# EAGLE board TAMSAT_OBC_v113 (EAGLE 6.5.0), part 1 of 2
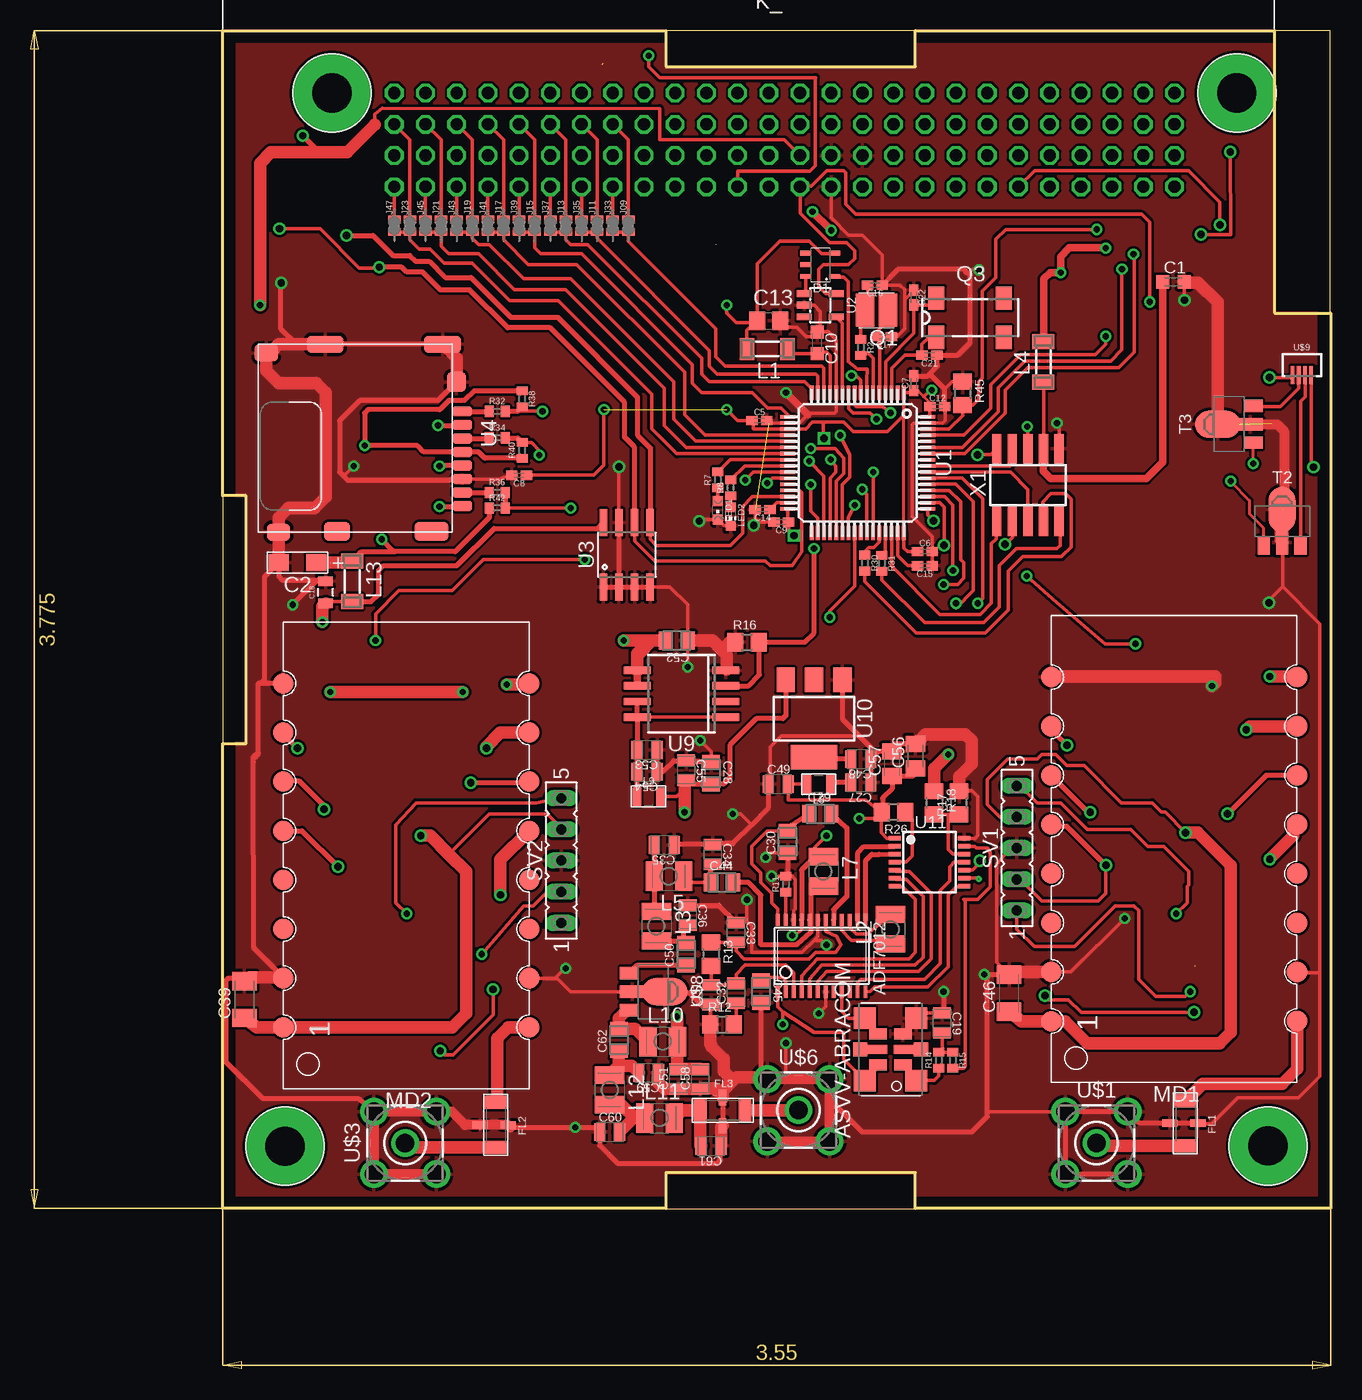
[diagram p4: board, top side]
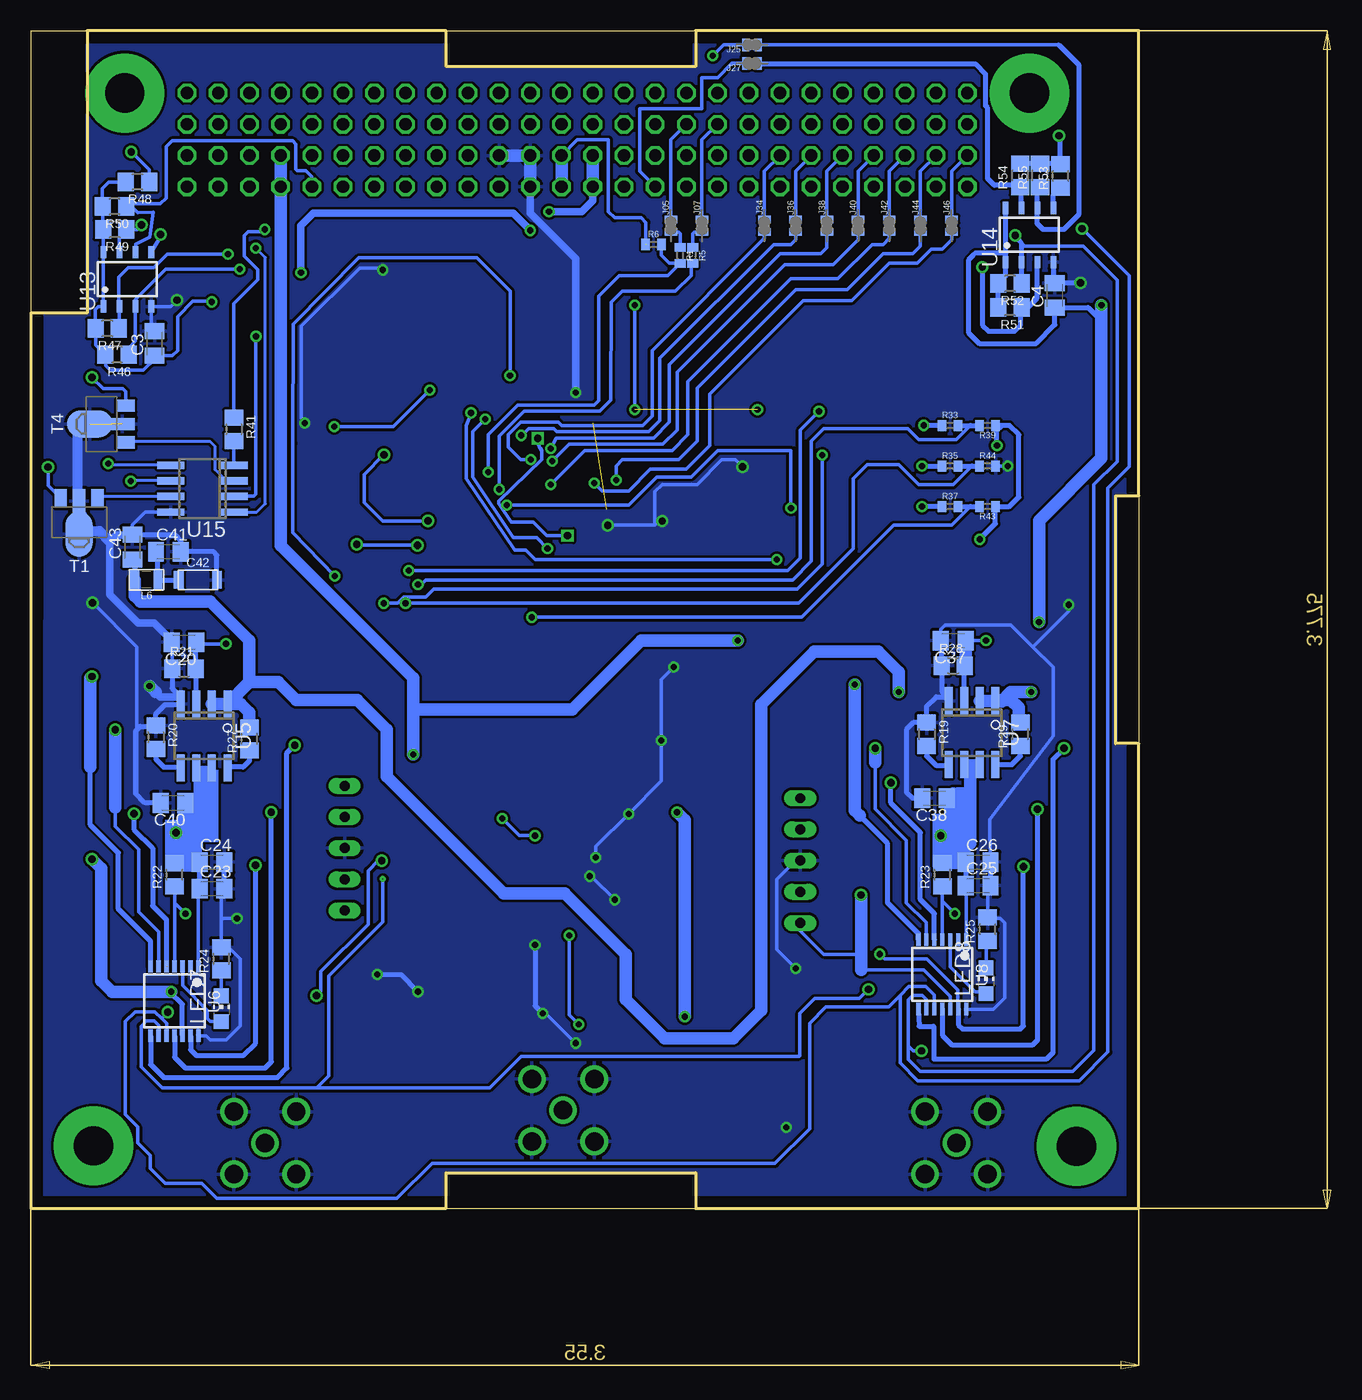
[diagram p5: board, bottom side, seen from below]

Size 90.19 x 95.89 mm. Coordinates in mm from the lower left corner, seen from the top.
Outline: 0,0 90.19,0 90.14,95.89 0,95.89 0,0
Copper layers (1*16): Top 0.035mm / dielectric 1.5mm / Bottom 0.035mm
Design rules "default": minimum track width 10mil, minimum drill 24mil, track to track 8mil, track to pad 8mil, pad to pad 8mil, via to via 8mil, smd to smd 8mil, copper to edge 40mil, drill to drill 8mil, minimum pad ring 10mil, minimum via ring 8mil, stop-mask expansion 4mil, vias tented up to drill 0mil, thermal gap 10mil
Net classes: 0 default: clearance 0.205 mm; 1 vcc: width 0.254 mm
Milling: 18 lines

## Footprints (pad centres in the part's own frame; a part is rotated, then mirrored left to right if it is on the bottom)
CRYSTAL-SMD-7.5X5.2-6PIN = smd 1.778 x 1.778: 1 -2.54,-2.1; 3 2.54,-2.1; 4 2.54,2.1; 6 -2.54,2.1 | smd 0.889 x 1.422: 1INNER -1.27,-1.016; 3INNER 1.27,-1.016; 4INNER 1.27,1.016; 6INNER -1.27,1.016 | smd 1.143 x 1.143: 2 0,-2.481; 5 0,2.481 | smd 0.711 x 1.778: 2INNER 0,-1.143; 5INNER 0,1.143
C0603K = smd 1.05 x 1.08: 1 -0.875,0; 2 0.875,0
C1206(3216) = smd 1.65 x 1.4: 1 -1.525,0; 2 1.525,0
C0805K = smd 1.3 x 1.6: 1 -1,0; 2 1,0
C0402K = smd 0.925 x 0.74: 1 -0.6,0; 2 0.6,0
C0805 = smd 1.3 x 1.5: 1 -0.95,0; 2 0.95,0
0805 = smd 0.8 x 1.2: 1 -0.9,0; 2 0.9,0
CAPC2013X140N = smd 0.914 x 1.448: 1 -0.813,0; 2 0.813,0
CAPC2012X94N = smd 1.118 x 1.448: 1 -0.914,0; 2 0.914,0
C1206K = smd 1.5 x 2: 1 -1.5,0; 2 1.5,0
C1206-GCM31 = smd 0.8 x 1.4: P$1 -1.55,0; P$2 1.55,0
SOT-25 = smd 0.9 x 0.4: 1 -1.175,0.95; 2 -1.175,-0.95; 3 1.175,-0.95; 4 1.175,0; 5 1.175,0.95
LFCN-XXX = smd 1.041 x 1.803: P$1 0,0; P$2 3.658,0 | smd 0.61 x 1.245: P$3 1.829,-1.27; P$4 1.829,1.016
JUMPER_MINI = smd 0.584 x 1.016: 1 -0.508,0; 2 0.508,0
CUBESAT_BRD = drill 1 pad 1.5 octagon: 1 13.97,88.265; 2 13.97,90.805; 3 16.51,88.265; 4 16.51,90.805; 5 19.05,88.265; 6 19.05,90.805; 7 21.59,88.265; 8 21.59,90.805; 9 24.13,88.265; 10 24.13,90.805; 11 26.67,88.265; 12 26.67,90.805; 13 29.21,88.265; 14 29.21,90.805; 15 31.75,88.265; 16 31.75,90.805; 17 34.29,88.265; 18 34.29,90.805; 19 36.83,88.265; 20 36.83,90.805; 21 39.37,88.265; 22 39.37,90.805; 23 41.91,88.265; 24 41.91,90.805; 25 44.45,88.265; 26 44.45,90.805; 27 46.99,88.265; 28 46.99,90.805; 29 49.53,88.265; 30 49.53,90.805; 31 52.07,88.265; 32 52.07,90.805; 33 54.61,88.265; 34 54.61,90.805; 35 57.15,88.265; 36 57.15,90.805; 37 59.69,88.265; 38 59.69,90.805; 39 62.23,88.265; 40 62.23,90.805; 41 64.77,88.265; 42 64.77,90.805; 43 67.31,88.265; 44 67.31,90.805; 45 69.85,88.265; 46 69.85,90.805; 47 72.39,88.265; 48 72.39,90.805; 49 74.93,88.265; 50 74.93,90.805; 51 77.47,88.265; 52 77.47,90.805; 53 13.97,83.185; 54 13.97,85.725; 55 16.51,83.185; 56 16.51,85.725; 57 19.05,83.185; 58 19.05,85.725; 59 21.59,83.185; 60 21.59,85.725; 61 24.13,83.185; 62 24.13,85.725; 63 26.67,83.185; 64 26.67,85.725; 65 29.21,83.185; 66 29.21,85.725; 67 31.75,83.185; 68 31.75,85.725; 69 34.29,83.185; 70 34.29,85.725; 71 36.83,83.185; 72 36.83,85.725; 73 39.37,83.185; 74 39.37,85.725; 75 41.91,83.185; 76 41.91,85.725; 77 44.45,83.185; 78 44.45,85.725; 79 46.99,83.185; 80 46.99,85.725; 81 49.53,83.185; 82 49.53,85.725; 83 52.07,83.185; 84 52.07,85.725; 85 54.61,83.185; 86 54.61,85.725; 87 57.15,83.185; 88 57.15,85.725; 89 59.69,83.185; 90 59.69,85.725; 91 62.23,83.185; 92 62.23,85.725; 93 64.77,83.185; 94 64.77,85.725; 95 67.31,83.185; 96 67.31,85.725; 97 69.85,83.185; 98 69.85,85.725; 99 72.39,83.185; 100 72.39,85.725; 101 74.93,83.185; 102 74.93,85.725; 103 77.47,83.185; 104 77.47,85.725
SM-1206 = smd 1.2 x 1.8: 1 -1.65,0; 2 1.65,0
L2825P = smd 1.4 x 2.4: 1 -1.2,0; 2 1.2,0
L805 = smd 0.7 x 1.5: 1 -0.95,0; 2 0.95,0
CHIPLED_0603 = smd 0.8 x 0.8: A 0,-0.75; C 0,0.75
CHIP-LED0603 = smd 0.8 x 0.8: A 0,-0.75; C 0,0.75
CHIP-LED0805 = smd 1.2 x 1.2: A 0,-1.05; C 0,1.05
RF4463F30 = smd 1.651 x 1.651: 1 33.02,0; 2 29,0; 3 25,0; 4 21,0; 5 17,0; 6 13,0; 7 9,0; 8 5,0; 9 5,20; 10 9,20; 11 13,20; 12 17,20; 13 21,20; 14 25,20; 15 29,20; 16 33,20
XTAL_SMD2 = smd 1.5 x 2.7: 1 -0.95,0.025; 2 0.95,0.025
MC-306 = smd 1.3 x 1.9: 1 -2.75,-1.6; 2 2.75,-1.6; 3 2.75,1.6; 4 -2.75,1.6
R0402 = smd 0.7 x 0.9: 1 -0.65,0; 2 0.65,0
R0805 = smd 1.3 x 1.5: 1 -0.95,0; 2 0.95,0
FE05-1 = drill 0.813 long: 1 -5.08,0; 2 -2.54,0; 3 0,0; 4 2.54,0; 5 5.08,0
SOT-89 = smd 1 x 1.5: 1 -1.499,-1.981; 3 1.499,-1.981 | smd 1 x 2: 2 0,-1.727 | smd 2.2 x 3.7: 2@1 0,0.94
TQFP64 = smd 1.2 x 0.3: 1 -5.7,3.75; 2 -5.7,3.25; 3 -5.7,2.75; 4 -5.7,2.25; 5 -5.7,1.75; 6 -5.7,1.25; 7 -5.7,0.75; 8 -5.7,0.25; 9 -5.7,-0.25; 10 -5.7,-0.75; 11 -5.7,-1.25; 12 -5.7,-1.75; 13 -5.7,-2.25; 14 -5.7,-2.75; 15 -5.7,-3.25; 16 -5.7,-3.75; 33 5.7,-3.75; 34 5.7,-3.25; 35 5.7,-2.75; 36 5.7,-2.25; 37 5.7,-1.75; 38 5.7,-1.25; 39 5.7,-0.75; 40 5.7,-0.25; 41 5.7,0.25; 42 5.7,0.75; 43 5.7,1.25; 44 5.7,1.75; 45 5.7,2.25; 46 5.7,2.75; 47 5.7,3.25; 48 5.7,3.75 | smd 0.3 x 1.2: 17 -3.75,-5.7; 18 -3.25,-5.7; 19 -2.75,-5.7; 20 -2.25,-5.7; 21 -1.75,-5.7; 22 -1.25,-5.7; 23 -0.75,-5.7; 24 -0.25,-5.7; 25 0.25,-5.7; 26 0.75,-5.7; 27 1.25,-5.7; 28 1.75,-5.7; 29 2.25,-5.7; 30 2.75,-5.7; 31 3.25,-5.7; 32 3.75,-5.7; 49 3.75,5.7; 50 3.25,5.7; 51 2.75,5.7; 52 2.25,5.7; 53 1.75,5.7; 54 1.25,5.7; 55 0.75,5.7; 56 0.25,5.7; 57 -0.25,5.7; 58 -0.75,5.7; 59 -1.25,5.7; 60 -1.75,5.7; 61 -2.25,5.7; 62 -2.75,5.7; 63 -3.25,5.7; 64 -3.75,5.7
SOT23-5 = smd 0.55 x 1.2: 1 -0.95,-1.3; 2 0,-1.3; 3 0.95,-1.3; 4 0.95,1.3; 5 -0.95,1.3
SO08 = smd 0.61 x 2.21: 1 -1.905,-2.616; 2 -0.635,-2.616; 3 0.635,-2.616; 4 1.905,-2.616; 5 1.905,2.616; 6 0.635,2.616; 7 -0.635,2.616; 8 -1.905,2.616
MICROSD = smd 0.8 x 1.6: 1 -2.03,9.47; 2 -0.93,9.47; 3 0.17,9.47; 4 1.27,9.47; 5 2.37,9.47; 6 3.47,9.47; 7 4.57,9.47; 8 5.67,9.47 | smd 1.55 x 2.8: 9 7.735,6.97 | smd 1.55 x 2.1: 10 7.735,-0.73 | smd 1.4 x 1.9: 11 7.81,-5.48; 12 -6.79,-6.48 | smd 1.4 x 3: 13 -7.49,-1.68; 14 -7.49,7.87 | smd 1.6 x 1.55: 15 -4.43,8.995
SO8 = smd 0.65 x 2.2: 1 -1.905,-2.6; 2 -0.635,-2.6; 3 0.635,-2.6; 4 1.905,-2.6; 5 1.905,2.6; 6 0.635,2.6; 7 -0.635,2.6; 8 -1.905,2.6
TSSOP14 = smd 0.35 x 1: 1 -1.95,-2.825; 2 -1.3,-2.825; 3 -0.65,-2.825; 4 0,-2.825; 5 0.65,-2.825; 6 1.3,-2.825; 7 1.95,-2.825; 8 1.95,2.825; 9 1.3,2.825; 10 0.65,2.825; 11 0,2.825; 12 -0.65,2.825; 13 -1.3,2.825; 14 -1.95,2.825
SOP-08 = smd 0.6 x 2.2: 1 -1.905,-3.6; 2 -0.635,-3.6; 3 0.635,-3.6; 4 1.905,-3.6; 5 1.905,3.575; 6 0.635,3.575; 7 -0.635,3.575; 8 -1.905,3.575
SOT223 = smd 1.5 x 2: 1 -2.3,-3.15; 2 0,-3.15; 3 2.3,-3.15 | smd 3.8 x 2: 4 0,3.15
ADF7012 = smd 0.991 x 0.305: 1_DVDD -2.918,3.829; 2_CREG1 -2.918,3.179; 3_CPOUT -2.918,2.529; 4_TXDATA -2.918,1.879; 5_TXCLK -2.918,1.229; 6_MUXOUT -2.918,0.579; 7_DGND -2.918,-0.071; 8_OSC1 -2.918,-0.721; 9_OSC2 -2.918,-1.371; 10_CLKOUT -2.918,-2.021; 11_CLK -2.918,-2.671; 12_DATA -2.918,-3.321; 13_LE 2.918,-3.321; 14_CE 2.918,-2.671; 15_L1 2.918,-2.021; 16_L2 2.918,-1.371; 17_CVCO 2.918,-0.721; 18_VCOIN 2.918,-0.071; 19_RFGND 2.918,0.579; 20_RFOUT 2.918,1.229; 21_DVDD 2.918,1.879; 22_AGND 2.918,2.529; 23_RSET 2.918,3.179; 24_CREG2 2.918,3.829
DGK-R-PDSO-G8 = smd 0.45 x 1: 1 -1.95,-2.21; 2 -0.65,-2.21; 3 0.65,-2.21; 4 1.95,-2.21; 5 1.95,2.21; 6 0.65,2.21; 7 -0.65,2.21; 8 -1.95,2.21
SO-08 = smd 0.6 x 2.2: 1 -1.905,-2.6; 2 -0.635,-2.6; 3 0.635,-2.6; 4 1.905,-2.6; 5 1.905,2.6; 6 0.635,2.6; 7 -0.635,2.6; 8 -1.905,2.6
SMA = drill 1.5 pad 2.2: 1 0,0; 2 -2.54,2.54; 3 2.54,2.54; 4 2.54,-2.54; 5 -2.54,-2.54
ANT_CON = smd 0.3 x 1.5: 1 -1.25,2.5; 2 -0.75,2.5; 3 -0.25,2.5; 4 0.25,2.5
1365-10 = smd 0.76 x 2.4: 1 -2.54,-2.95; 2 -2.54,2.95; 3 -1.27,-2.95; 4 -1.27,2.95; 5 0,-2.95; 6 0,2.95; 7 1.27,-2.95; 8 1.27,2.95; 9 2.54,-2.95; 10 2.54,2.95

## Placement (x,y rotation side)
ASVV-ABRACOM  OSCILLATORSMD6  [CRYSTAL-SMD-7.5X5.2-6PIN]  54.36,12.97 90 top
C1  1uF  [C0603K]  77.38,75.45 0 top
C2  10uF  [C1206(3216)]  6.1,52.59 180 top
C3  10nF  [C0805K]  80.11,70.43 90 bottom
C4  10nF  [C0805K]  6.85,74.36 90 bottom
C5  100nF  [C0402K]  43.69,64.15 0 top
C6  100nF  [C0402K]  57.15,53.48 0 top
C7  100nF  [C0402K]  56.26,67.2 90 top
C8  100nF  [C0402K]  24.13,59.71 180 top
C9  100nF  [C0402K]  45.47,55.9 180 top
C10  100nF  [C0603K]  48.39,70.5 270 top
C12  100nF  [C0402K]  58.17,65.29 0 top
C13  1uF  [C0805]  44.45,72.28 0 top
C14  2.2uF  [C0402K]  43.94,56.91 180 top
C15  2.2uF  [C0402K]  57.15,52.34 180 top
C16  22pF  [C0402K]  53.09,75.2 180 top
C17  22pF  [C0402K]  53.85,71.01 180 top
C18  10nF  [0805]  8.38,50.18 90 top
C19  [CAPC2013X140N]  58.55,15.13 270 top
C20  1uF  [C0805K]  77.72,46.12 180 bottom
C21  6.8pF  [C0402K]  57.53,69.48 180 top
C22  6.8pF  [C0402K]  56.26,74.18 270 top
C23  100nF  [C0805K]  75.44,26.05 0 bottom
C24  100pF  [C0805K]  75.44,28.21 0 bottom
C25  100nF  [C0805K]  13.08,26.3 0 bottom
C26  100pF  [C0805K]  13.08,28.21 0 bottom
C27  10UF  [CAPC2013X140N]  51.94,34.69 180 top
C28  0.1UF  [CAPC2012X94N]  39.75,35.45 270 top
C29  22n  [CAPC2012X94N]  48.64,32.15 0 top
C30  470n  [CAPC2012X94N]  45.97,29.86 90 top
C31  [CAPC2013X140N]  39.75,17.41 90 top
C32  [CAPC2013X140N]  41.78,17.54 90 top
C33  [CAPC2013X140N]  41.78,22.49 270 top
C34  [CAPC2013X140N]  39.88,28.84 270 top
C35  [CAPC2013X140N]  35.94,29.61 180 top
C36  [CAPC2013X140N]  37.85,23.89 270 top
C37  1uF  [C0805K]  15.11,46.24 180 bottom
C38  100nF  [C0805K]  16.64,33.42 180 bottom
C39  10uF  [C1206K]  1.78,17.03 90 top
C40  100nF  [C0805K]  78.61,33.04 180 bottom
C41  10nF  [C0805K]  78.99,53.48 0 bottom
C42  22uF,1210  [C1206-GCM31]  76.58,51.2 0 bottom
C43  100nF  [C0805K]  81.91,53.86 90 bottom
C44  [CAPC2012X94N]  40.64,26.56 0 top
C45  [CAPC2012X94N]  43.82,17.67 270 top
C46  10uF  [C1206K]  64.01,17.54 90 top
C48  100n  [CAPC2013X140N]  51.94,36.59 180 top
C49  100n  [CAPC2013X140N]  45.21,34.56 0 top
C50  [CAPC2012X94N]  37.72,20.72 90 top
C51  [CAPC2013X140N]  37.08,10.56 90 top
C52  0.1UF  [CAPC2012X94N]  36.96,46.24 180 top
C53  10UF  [CAPC2013X140N]  34.54,37.35 180 top
C54  100n  [CAPC2013X140N]  34.54,35.58 180 top
C55  100n  [CAPC2013X140N]  37.72,35.7 270 top
C56  100nF  [C0805K]  56.39,36.84 90 top
C57  100pF  [C0805K]  54.48,36.21 90 top
C58  [CAPC2013X140N]  38.86,10.56 90 top
C59  [CAPC2013X140N]  34.67,11.06 180 top
C60  [CAPC2013X140N]  31.5,6.24 0 top
C61  [CAPC2013X140N]  39.75,5.1 180 top
C62  [CAPC2012X94N]  32.26,13.73 90 top
D1  SBE805  [SOT-25]  48.64,76.85 180 top
FL1  LFCN-XXX  [LFCN-XXX]  78.36,8.78 270 top
FL2  LFCN-XXX  [LFCN-XXX]  22.23,8.65 270 top
FL3  LFCN-XXX  [LFCN-XXX]  38.86,8.02 0 top
J05  [JUMPER_MINI]  38.1,80.03 90 bottom
J07  [JUMPER_MINI]  35.56,80.03 90 bottom
J09  [JUMPER_MINI]  33.02,80.03 90 top
J11  [JUMPER_MINI]  30.48,80.03 90 top
J13  [JUMPER_MINI]  27.94,80.03 90 top
J15  [JUMPER_MINI]  25.4,80.03 90 top
J17  [JUMPER_MINI]  22.86,80.03 90 top
J19  [JUMPER_MINI]  20.32,80.03 90 top
J21  [JUMPER_MINI]  17.78,80.03 90 top
J23  [JUMPER_MINI]  15.24,80.03 90 top
J25  [JUMPER_MINI]  31.5,94.76 180 bottom
J27  [JUMPER_MINI]  31.5,93.23 180 bottom
J33  [JUMPER_MINI]  31.75,80.03 90 top
J34  [JUMPER_MINI]  30.48,80.03 90 bottom
J35  [JUMPER_MINI]  29.21,80.03 90 top
J36  [JUMPER_MINI]  27.94,80.03 90 bottom
J37  [JUMPER_MINI]  26.67,80.03 90 top
J38  [JUMPER_MINI]  25.4,80.03 90 bottom
J39  [JUMPER_MINI]  24.13,80.03 90 top
J40  [JUMPER_MINI]  22.86,80.03 90 bottom
J41  [JUMPER_MINI]  21.59,80.03 90 top
J42  [JUMPER_MINI]  20.32,80.03 90 bottom
J43  [JUMPER_MINI]  19.05,80.03 90 top
J44  [JUMPER_MINI]  17.78,80.03 90 bottom
J45  [JUMPER_MINI]  16.51,80.03 90 top
J46  [JUMPER_MINI]  15.24,80.03 90 bottom
J47  [JUMPER_MINI]  13.97,80.03 90 top
K_  CUBESAT_HEADER  [CUBESAT_BRD]  0,0.02 0 top
L1  fcm1608-0603 (1206)  [SM-1206]  44.32,69.99 180 top
L2  100uH  [L2825P]  54.36,22.75 90 top
L3  XX  [L2825P]  35.31,23 270 top
L4  fcm1608-0603 (1206)  [SM-1206]  66.8,68.94 90 top
L5  XX  [L2825P]  36.32,27.07 180 top
L6  7 R Ferrite Bead, 3A  [L805]  80.77,51.2 180 bottom
L7  XX  [L2825P]  48.9,27.45 270 top
L8  7 R Ferrite Bead, 3A  [L805]  48.51,34.56 180 top
L9  7 R Ferrite Bead, 3A  [L805]  34.67,33.54 0 top
L10  100uH  [L2825P]  35.81,13.6 0 top
L11  XX  [L2825P]  35.56,7.38 0 top
L12  XX  [L2825P]  31.5,9.67 270 top
L13  fcm1608-0603 (1206)  [SM-1206]  10.54,51.07 270 top
LED1  RED  [CHIPLED_0603]  40.31,56.86 180 top
LED2  GREEN  [CHIP-LED0603]  41.34,56.34 180 top
LED7  ORNG  [CHIP-LED0805]  74.68,16.27 0 bottom
LED8  GRN  [CHIP-LED0805]  12.45,18.56 0 bottom
MD1  RF4463F30  [RF4463F30]  67.44,48.27 270 top
MD2  RF4463F30  [RF4463F30]  4.95,47.77 270 top
Q1  8Mhz  [XTAL_SMD2]  53.21,73.17 180 top
Q3  32.768  [MC-306]  60.83,72.53 0 top
R1  150  [R0402]  37.34,77.61 270 bottom
R2  220  [R0402]  51.94,70.12 270 top
R5  150  [R0402]  36.32,77.61 270 bottom
R6  5K1  [R0402]  39.5,78.5 0 bottom
R7  680  [R0402]  40.31,59.33 90 top
R8  680  [R0402]  41.34,58.69 90 top
R11  [R0402]  45.85,26.43 90 top
R12  [R0805]  40.64,15 0 top
R13  [R0805]  39.75,20.72 270 top
R14  [R0402]  58.29,12.08 90 top
R15  [R0402]  59.44,12.08 270 top
R16  [R0805]  42.67,46.12 0 top
R17  [R0805]  59.94,33.04 90 top
R18  [R0805]  57.91,33.04 270 top
R19  3K3  [R0805]  17.27,38.62 270 bottom
R20  3K3  [R0805]  80.01,38.37 270 bottom
R21  100k  [R0805]  77.72,43.96 0 bottom
R22  [R0805]  78.49,27.19 90 bottom
R23  [R0805]  16,27.19 90 bottom
R24  [R0805]  74.68,20.34 90 bottom
R25  [R0805]  12.32,22.75 90 bottom
R26  [R0805]  54.61,32.27 180 top
R27  100k  [R0805]  72.39,38.24 90 bottom
R28  100k  [R0805]  15.11,44.21 0 bottom
R29  100k  [R0805]  9.65,38.62 90 bottom
R30  27  [R0402]  52.27,52.56 270 top
R31  27  [R0402]  53.65,52.54 270 top
R32  22  [R0402]  22.35,64.91 0 top
R33  22  [R0402]  15.37,63.77 0 bottom
R34  22  [R0402]  22.35,62.75 0 top
R35  22  [R0402]  15.37,60.47 0 bottom
R36  22  [R0402]  22.35,58.31 0 top
R37  22  [R0402]  15.37,57.16 0 bottom
R38  22  [R0402]  24.38,65.93 270 top
R39  22  [R0402]  12.32,63.77 180 bottom
R40  22  [R0402]  24.38,61.74 90 top
R41  1K  [R0805]  73.66,63.45 270 bottom
R42  22  [R0402]  22.35,57.04 0 top
R43  22  [R0402]  12.32,57.16 180 bottom
R44  22  [R0402]  12.32,60.47 0 bottom
R45  2K2  [R0805]  60.22,66.37 270 top
R46  10K  [R0805]  83.18,69.53 180 bottom
R47  10K  [R0805]  83.96,71.65 180 bottom
R48  10K  [R0805]  81.5,83.58 180 bottom
R49  2K7  [R0805]  83.35,79.71 180 bottom
R50  2K7  [R0805]  83.36,81.58 180 bottom
R51  10K  [R0805]  10.5,73.36 180 bottom
R52  10K  [R0805]  10.49,75.32 180 bottom
R53  10K  [R0805]  6.37,84.08 90 bottom
R54  2K7  [R0805]  9.66,84.12 90 bottom
R55  2K7  [R0805]  8.04,84.12 90 bottom
SV1  [FE05-1]  64.64,29.35 90 top
SV2  [FE05-1]  27.56,28.34 90 top
T1  [SOT-89]  86.25,55.86 180 bottom
T2  [SOT-89]  86.23,55.97 0 top
T3  [SOT-89]  81.91,63.86 90 top
T4  [SOT-89]  84.45,63.88 90 bottom
U1  STM32F405R  [TQFP64]  51.69,60.72 270 top
U2  TPS3824  [SOT23-5]  48.64,73.55 270 top
U3  EEPROM-I2CSMD  [SO08]  32.89,53.23 0 top
U4  MICROSD  [MICROSD]  10.03,62.88 270 top
U5  MAX890L  [SO8]  76.07,38.5 180 bottom
U6  PIC16LF1825-TSSOP14  [TSSOP14]  78.49,16.91 180 bottom
U7  MAX890L  [SO8]  13.59,38.75 180 bottom
U8  PIC16LF1825-TSSOP14  [TSSOP14]  16,19.07 180 bottom
U9  TPS77350  [SOP-08]  37.34,41.93 90 top
U10  LD117AS33TR  [SOT223]  48.13,39.89 180 top
U11  PIC16LF1825-TSSOP14  [TSSOP14]  57.53,28.21 270 top
U12  ADF7012  [ADF7012]  49.01,20.58 90 top
U13  LTC4307  [DGK-R-PDSO-G8]  82.33,75.66 0 bottom
U14  LTC4307  [DGK-R-PDSO-G8]  8.91,79.27 0 bottom
U15  PIC12F675SN  [SO-08]  76.21,58.62 90 bottom
U$1  SMA-KONNEKTOR  [SMA]  71.12,5.35 0 top
U$3  SMA-KONNEKTOR  [SMA]  14.86,5.35 90 top
U$6  SMA-KONNEKTOR  [SMA]  46.86,8.02 0 top
U$8  PD85004  [SOT-89]  35.05,17.67 270 top
U$9  ANT_CONN_4  [ANT_CON]  87.33,70.36 180 top
X1  1365-10  [1365-10]  65.54,58.92 0 top